# Altium schematic sheet ethernet.SchDoc
size 297 x 209 mm; DrawnBy: Supun; Engineer: Supun; Organization: C3
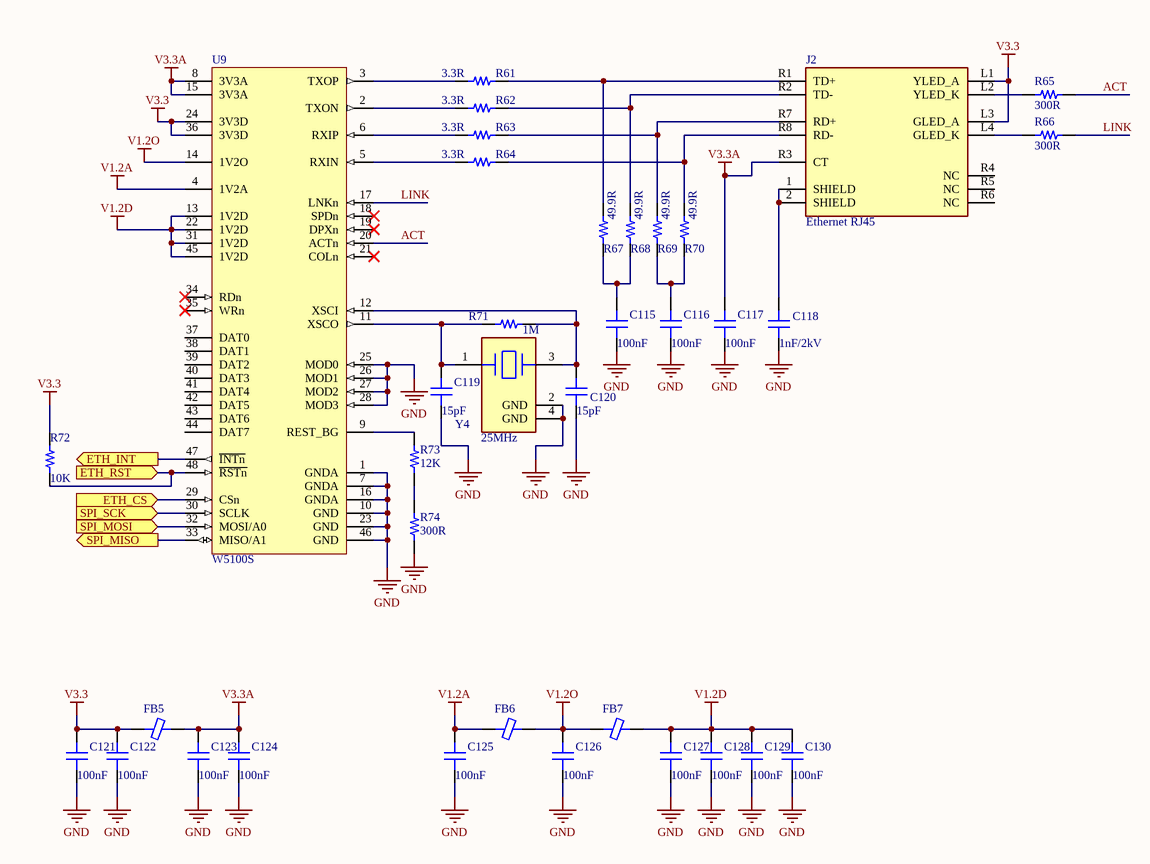
[diagram p0: ethernet.SchDoc]

## Parts
C115  100nF  [CAP 0603_1608]
C116  100nF  [CAP 0603_1608]
C117  100nF  [CAP 0603_1608]
C118  1nF/2kV  [CAP 1206_3216]
C119  15pF  [CAP 0603_1608]
C120  15pF  [CAP 0603_1608]
C121  100nF  [CAP 0603_1608]
C122  100nF  [CAP 0603_1608]
C123  100nF  [CAP 0603_1608]
C124  100nF  [CAP 0603_1608]
C125  100nF  [CAP 0603_1608]
C126  100nF  [CAP 0603_1608]
C127  100nF  [CAP 0603_1608]
C128  100nF  [CAP 0603_1608]
C129  100nF  [CAP 0603_1608]
C130  100nF  [CAP 0603_1608]
FB5  Ferrite Beads  [Murata_BLM18-0_15-t0_8_MFG]  (value not drawn)
FB6  Ferrite Beads  [Murata_BLM18-0_15-t0_8_MFG]  (value not drawn)
FB7  Ferrite Beads  [Murata_BLM18-0_15-t0_8_MFG]  (value not drawn)
J2  Ethernet RJ45  [WIZnet_RB1-125BAG1A_0]
R61  3.3R  [RES 0603_1608]
R62  3.3R  [RES 0603_1608]
R63  3.3R  [RES 0603_1608]
R64  3.3R  [RES 0603_1608]
R65  300R  [RES 0603_1608]
R66  300R  [RES 0603_1608]
R67  49.9R  [RES 0603_1608]
R68  49.9R  [RES 0603_1608]
R69  49.9R  [RES 0603_1608]
R70  49.9R  [RES 0603_1608]
R71  1M  [RES 0603_1608]
R72  10K  [RES 0603_1608]
R73  12K  [RES 0603_1608]
R74  300R  [RES 0603_1608]
U9  W5100S  [WIZ-W5500-LQFP-48_N]
Y4  25MHz  [ABRACON ABM8G]

## Ports
ETH_CS (in), ETH_INT (out), ETH_RST (in), SPI_MISO (out), SPI_MOSI (in), SPI_SCK (in)

## Nets
GND: C115.2 C116.2 C117.2 C118.1 C119.1 C120.1 C121.2 C122.2 C123.2 C124.2 C125.2 C126.2 C127.2 C128.2 C129.2 C130.2 R74.1 U9.1(GNDA) U9.7(GNDA) U9.10(GND) U9.16(GNDA) U9.23(GND) U9.25(MOD0) U9.26(MOD1) U9.27(MOD2) U9.28(MOD3) U9.46(GND) Y4.2(GND) Y4.4(GND)
V1.2A: C125.1 FB6.1 U9.4(1V2A)
V1.2D: C127.1 C128.1 C129.1 C130.1 FB7.2 U9.13(1V2D) U9.22(1V2D) U9.31(1V2D) U9.45(1V2D)
V1.2O: C126.1 FB6.2 FB7.1 U9.14(1V2O)
V3.3: C121.1 C122.1 FB5.1 J2.L1(YLED_A) J2.L3(GLED_A) R72.2 U9.24(3V3D) U9.36(3V3D)
V3.3A: C117.1 C123.1 C124.1 FB5.2 J2.R3(CT) U9.8(3V3A) U9.15(3V3A)
ACT: R65.2 U9.20(ACTn)
ETH_CS: U9.29(CSn) ; port ETH_CS
ETH_INT: U9.47(~{INTn}) ; port ETH_INT
ETH_RST: R72.1 U9.48(~{RSTn}) ; port ETH_RST
LINK: R66.2 U9.17(LNKn)
SPI_MISO: U9.33(MISO/A1) ; port SPI_MISO
SPI_MOSI: U9.32(MOSI/A0) ; port SPI_MOSI
SPI_SCK: U9.30(SCLK) ; port SPI_SCK
NetC115_1: C115.1 R67.1 R68.1
NetC116_1: C116.1 R69.1 R70.1
NetC118_2: C118.2 J2.1(SHIELD) J2.2(SHIELD)
NetC119_2: C119.2 R71.2 U9.11(XSCO) Y4.1
NetC120_2: C120.2 R71.1 U9.12(XSCI) Y4.3
NetJ2_L2: J2.L2(YLED_K) R65.1
NetJ2_L4: J2.L4(GLED_K) R66.1
NetJ2_R1: J2.R1(TD+) R61.2 R67.2
NetJ2_R2: J2.R2(TD-) R62.2 R68.2
NetJ2_R7: J2.R7(RD+) R63.2 R69.2
NetJ2_R8: J2.R8(RD-) R64.2 R70.2
NetR61_1: R61.1 U9.3(TXOP)
NetR62_1: R62.1 U9.2(TXON)
NetR63_1: R63.1 U9.6(RXIP)
NetR64_1: R64.1 U9.5(RXIN)
NetR73_1: R73.1 R74.2
NetR73_2: R73.2 U9.9(REST_BG)

Not connected (* = marked no-connect by the designer): J2 R4(NC) R5(NC) R6(NC); U9 18(SPDn)* 19(DPXn)* 21(COLn)* 34(RDn)* 35(WRn)* 37(DAT0) 38(DAT1) 39(DAT2) 40(DAT3) 41(DAT4) 42(DAT5) 43(DAT6) 44(DAT7)

## Notes on the sheet
- Title
- Size:
- Date:
- A4
- Number:
- Time:
- Revision:
- Sheet
- of
- File:

## Library data of the parts
C115-C117 C121-C130 = Capacitor: SMT Capacitor; MF: TDK; MP: CGA3E2X7R1E104K080AA; Value: 100nF; Link: https://www.mouser.com/ProductDetail/TDK/CGA3E2X7R1E104K080AA?qs=NRhsANhppD%2Fm7%2FOmmsm0vg%3D%3D
C118 = Capacitor: SMT Capacitor; MF: KEMET; MP: C1206C102KGRAC; Value: 1nF/2kV; Link: https://www.mouser.com/ProductDetail/KEMET/C1206C102KGRAC?qs=1RE3cBpaOWtt6EeFSGrZqA%3D%3D
C119 C120 = Capacitor: SMT Capacitor; MF: Murata; MP: GRM1885C1H150JA01J; Value: 15pF; Link: https://www.mouser.com/ProductDetail/Murata-Electronics/GRM1885C1H150JA01J?qs=6X6%252BjuxzJaBd4%252Bvb3bD5Gw%3D%3D
FB5-FB7 = Ferrite Chip: SMT Ferrite Chip; MF: TDK; MP: MAF1608GAD601CT000; Value: *; Link: https://www.mouser.com/ProductDetail/TDK/MAF1608GAD601CT000?qs=ahcBuItHZ3yA8sILv6RqMA%3D%3D
J2 = Ethernet RJ45: Modular Connectors / Ethernet Connectors RJ-45 w/ Transformer connector/ude; MF: WIZnet; MP: RB1-125BAG1A; Value: *; Link: https://www.mouser.com/ProductDetail/WIZnet/RB1-125BAG1A?qs=K8aI8m0%252Bj2HL3CgJHC4yWQ%3D%3D
R61-R64 = Resistor: SMT Resistor; MF: YAGEO; MP: AC0603FR-073R3L; Value: 3.3R; Link: https://www.mouser.com/ProductDetail/YAGEO/AC0603FR-073R3L?qs=sGAEpiMZZMvdGkrng054t3GzUHVMl1Seuwtsq%2FmjAJLJc5%252B9y23KyA%3D%3D
R65 R66 R74 = Resistor: SMT Resistor; MF: YAGEO; MP: AC0603FR-07300RL; Value: 300R; Link: https://www.mouser.com/ProductDetail/YAGEO/AC0603FR-07300RL?qs=yhV1fb9g%2FKYRCKndxB9juA%3D%3D
R67-R70 = Resistor: SMT Resistor; MF: YAGEO; MP: AC0603FR-0749R9L; Value: 49.9R; Link: https://www.mouser.com/ProductDetail/YAGEO/AC0603FR-0749R9L?qs=ygRr%2FtkhteuuNLaoU8EXeQ%3D%3D
R71 = Resistor: SMT Resistor; MF: YAGEO; MP: AC0603FR-071ML; Value: 1M; Link: https://www.mouser.com/ProductDetail/YAGEO/AC0603FR-071ML?qs=UoPT7wUmgYLqjUDINK%252BbdQ%3D%3D
R72 = Resistor: SMT Resistor; MF: YAGEO; MP: AC0603FR-0710KL; Value: 10K; Link: https://www.mouser.com/ProductDetail/YAGEO/AC0603FR-0710KL?qs=UoPT7wUmgYKz3zh0UDMA4Q%3D%3D
R73 = Resistor: SMT Resistor; MF: YAGEO; MP: AC0603FR-0712KL; Value: 12K; Link: https://www.mouser.com/ProductDetail/YAGEO/AC0603FR-0712KL?qs=yhV1fb9g%2FKamCgqiemhojw%3D%3D
U9 = W5100S: Ethernet ICs 10/100 Base-T/TX PHY SPI Interface 7x7; MF: WIZnet; MP: W5100S-L; Value: *; Link: https://www.mouser.com/ProductDetail/WIZnet/W5100S-L?qs=wnTfsH77Xs6eczkKf5LdDg%3D%3D
Y4 = Crystal: Crystals AEC-Q200 CRYSTAL 4pin SMD; MF: ECS; MP: ECS-250-12-33-AGN-TR3; Value: 25MHz; Link: https://www.mouser.com/ProductDetail/ECS/ECS-250-12-33-AGN-TR3?qs=e8oIoAS2J1QPB2oXa%2FBSbw%3D%3D